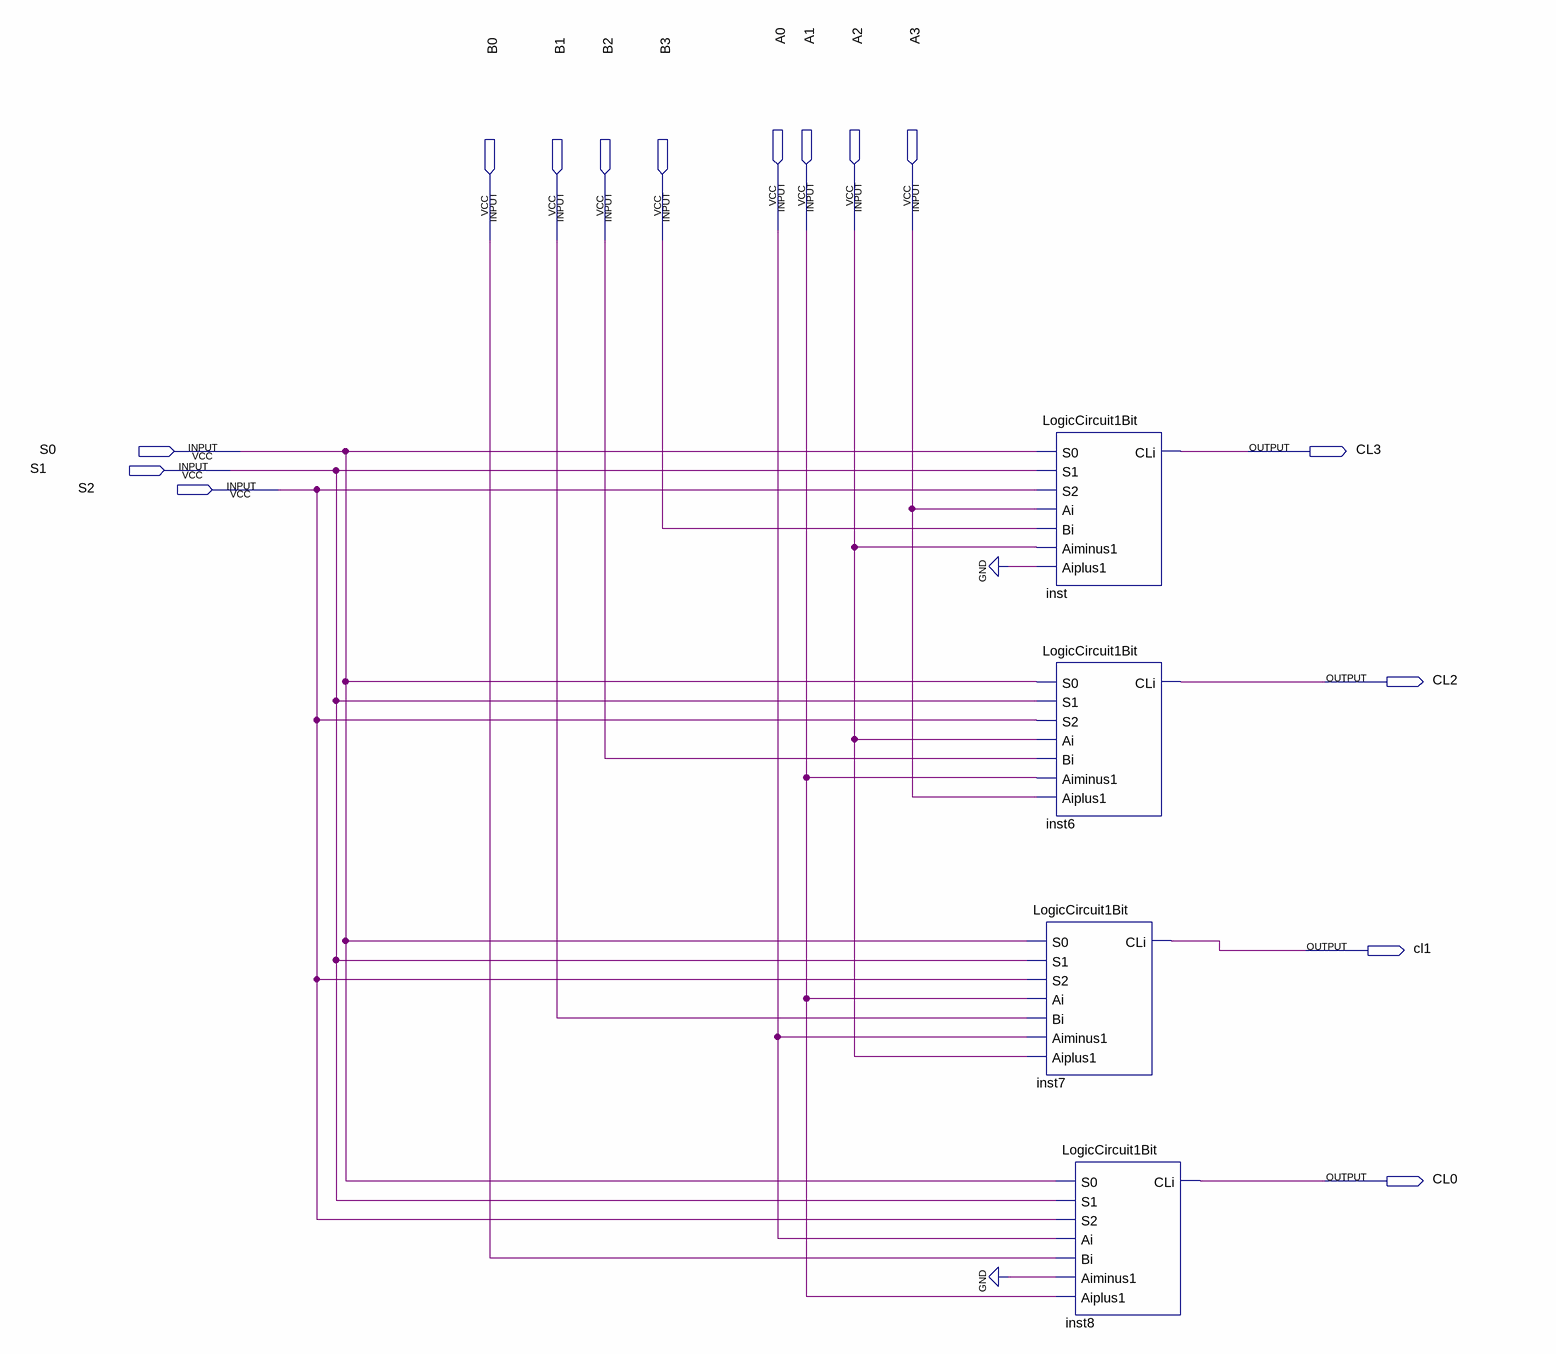
[diagram p0: schematic sheet]
// Quartus schematic LogicCircuit4Bit.bdf as structural Verilog: 4 symbols, 15 pins
module LogicCircuit4Bit (
  input  A0,
  input  A1,
  input  A2,
  input  A3,
  input  B0,
  input  B1,
  input  B2,
  input  B3,
  input  S0,
  input  S1,
  input  S2,
  output CL3,
  output CL2,
  output cl1,
  output CL0
);

  LogicCircuit1Bit inst (.S0(S0), .S1(S1), .S2(S2), .Ai(A3), .Bi(B3), .Aiminus1(A2), .Aiplus1(1'b0), .CLi(CL3));
  LogicCircuit1Bit inst6 (.S0(S0), .S1(S1), .S2(S2), .Ai(A2), .Bi(B2), .Aiminus1(A1), .Aiplus1(A3), .CLi(CL2));
  LogicCircuit1Bit inst7 (.S0(S0), .S1(S1), .S2(S2), .Ai(A1), .Bi(B1), .Aiminus1(A0), .Aiplus1(A2), .CLi(cl1));
  LogicCircuit1Bit inst8 (.S0(S0), .S1(S1), .S2(S2), .Ai(A0), .Bi(B0), .Aiminus1(1'b0), .Aiplus1(A1), .CLi(CL0));
endmodule
